# Altium schematic sheet SoM-HighSpeed.SchDoc
size A3; DocumentNumber: 3; SheetNumber: 3; SheetTotal: 9; PageSetup: Record=PageOptions|CenterHorizontal=True|CenterVertical=True|PrintScale=0.97|XCorrection=1.00|YCorrection=1.00|PrintKind=1|BorderSize=5000000|LeftOffset=0|BottomOffset=0|Orientation=2|PaperLength=2970|PaperWidth=2100|Scale=100|PaperSource=7|PrintQuality=600|MediaType=1|DitherType=10|PaperKind=A4|PrintScaleMode=1
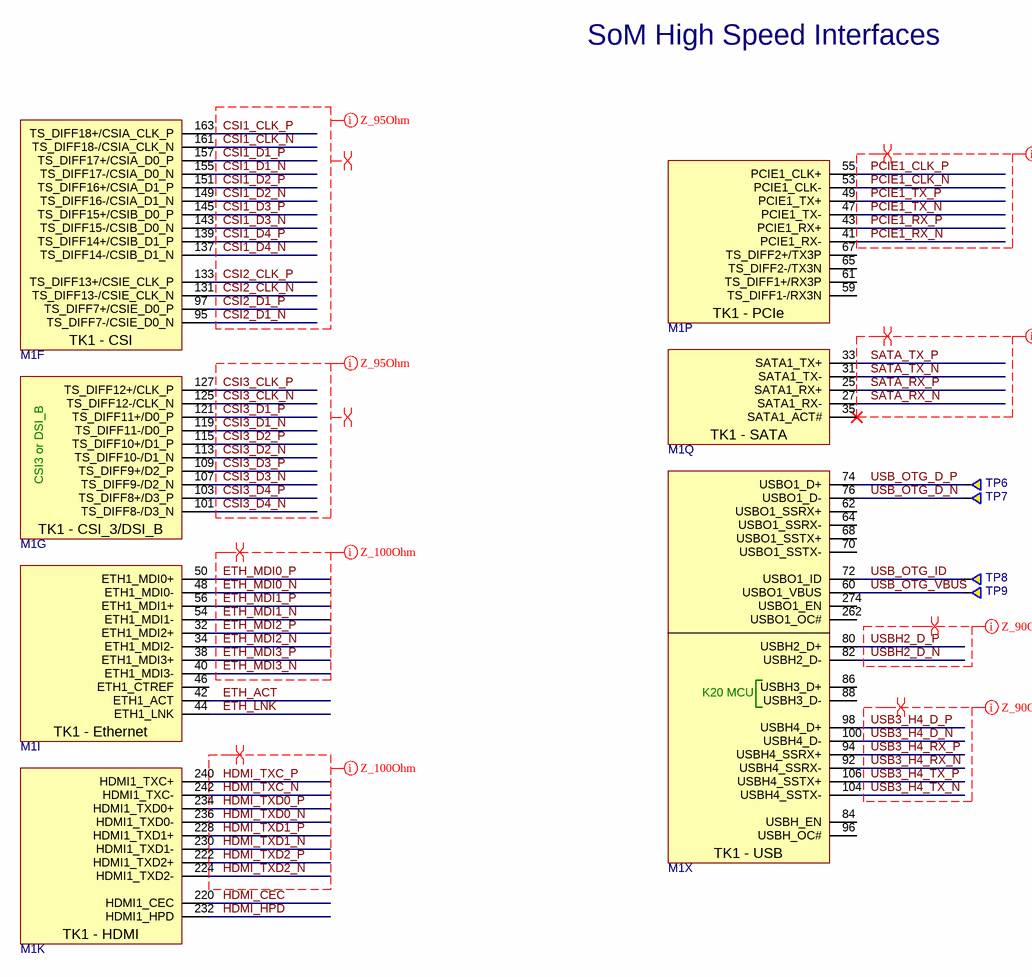
[diagram p0: SoM-HighSpeed.SchDoc]

## Parts
M1  MM70-314-310B1  [Apalis-H]  (value not drawn)  (parts F,G,I,K,P,Q,X of 25)
TP6  TP-R-1.5  [TP-R-1.5]  (value not drawn)  (no BOM)
TP7  TP-R-1.5  [TP-R-1.5]  (value not drawn)  (no BOM)
TP8  TP-R-1.5  [TP-R-1.5]  (value not drawn)  (no BOM)
TP9  TP-R-1.5  [TP-R-1.5]  (value not drawn)  (no BOM)

## Nets
CSI1_CLK_N: M1.161(TS_DIFF18-/CSIA_CLK_N)
CSI1_CLK_P: M1.163(TS_DIFF18+/CSIA_CLK_P)
CSI1_D1_N: M1.155(TS_DIFF17-/CSIA_D0_N)
CSI1_D1_P: M1.157(TS_DIFF17+/CSIA_D0_P)
CSI1_D2_N: M1.149(TS_DIFF16-/CSIA_D1_N)
CSI1_D2_P: M1.151(TS_DIFF16+/CSIA_D1_P)
CSI1_D3_N: M1.143(TS_DIFF15-/CSIB_D0_N)
CSI1_D3_P: M1.145(TS_DIFF15+/CSIB_D0_P)
CSI1_D4_N: M1.137(TS_DIFF14-/CSIB_D1_N)
CSI1_D4_P: M1.139(TS_DIFF14+/CSIB_D1_P)
CSI2_CLK_N: M1.131(TS_DIFF13-/CSIE_CLK_N)
CSI2_CLK_P: M1.133(TS_DIFF13+/CSIE_CLK_P)
CSI2_D1_N: M1.95(TS_DIFF7-/CSIE_D0_N)
CSI2_D1_P: M1.97(TS_DIFF7+/CSIE_D0_P)
CSI3_CLK_N: M1.125(TS_DIFF12-/CLK_N)
CSI3_CLK_P: M1.127(TS_DIFF12+/CLK_P)
CSI3_D1_N: M1.119(TS_DIFF11-/D0_P)
CSI3_D1_P: M1.121(TS_DIFF11+/D0_P)
CSI3_D2_N: M1.113(TS_DIFF10-/D1_N)
CSI3_D2_P: M1.115(TS_DIFF10+/D1_P)
CSI3_D3_N: M1.107(TS_DIFF9-/D2_N)
CSI3_D3_P: M1.109(TS_DIFF9+/D2_P)
CSI3_D4_N: M1.101(TS_DIFF8-/D3_N)
CSI3_D4_P: M1.103(TS_DIFF8+/D3_P)
ETH_ACT: M1.42(ETH1_ACT)
ETH_LNK: M1.44(ETH1_LNK)
ETH_MDI0_N: M1.48(ETH1_MDI0-)
ETH_MDI0_P: M1.50(ETH1_MDI0+)
ETH_MDI1_N: M1.54(ETH1_MDI1-)
ETH_MDI1_P: M1.56(ETH1_MDI1+)
ETH_MDI2_N: M1.34(ETH1_MDI2-)
ETH_MDI2_P: M1.32(ETH1_MDI2+)
ETH_MDI3_N: M1.40(ETH1_MDI3-)
ETH_MDI3_P: M1.38(ETH1_MDI3+)
HDMI_CEC: M1.220(HDMI1_CEC)
HDMI_HPD: M1.232(HDMI1_HPD)
HDMI_TXC_N: M1.242(HDMI1_TXC-)
HDMI_TXC_P: M1.240(HDMI1_TXC+)
HDMI_TXD0_N: M1.236(HDMI1_TXD0-)
HDMI_TXD0_P: M1.234(HDMI1_TXD0+)
HDMI_TXD1_N: M1.230(HDMI1_TXD1-)
HDMI_TXD1_P: M1.228(HDMI1_TXD1+)
HDMI_TXD2_N: M1.224(HDMI1_TXD2-)
HDMI_TXD2_P: M1.222(HDMI1_TXD2+)
PCIE1_CLK_N: M1.53(PCIE1_CLK-)
PCIE1_CLK_P: M1.55(PCIE1_CLK+)
PCIE1_RX_N: M1.41(PCIE1_RX-)
PCIE1_RX_P: M1.43(PCIE1_RX+)
PCIE1_TX_N: M1.47(PCIE1_TX-)
PCIE1_TX_P: M1.49(PCIE1_TX+)
SATA_RX_N: M1.27(SATA1_RX-)
SATA_RX_P: M1.25(SATA1_RX+)
SATA_TX_N: M1.31(SATA1_TX-)
SATA_TX_P: M1.33(SATA1_TX+)
USB3_H4_D_N: M1.100(USBH4_D-)
USB3_H4_D_P: M1.98(USBH4_D+)
USB3_H4_RX_N: M1.92(USBH4_SSRX-)
USB3_H4_RX_P: M1.94(USBH4_SSRX+)
USB3_H4_TX_N: M1.104(USBH4_SSTX-)
USB3_H4_TX_P: M1.106(USBH4_SSTX+)
USB_OTG_D_N: M1.76(USBO1_D-) TP7.1
USB_OTG_D_P: M1.74(USBO1_D+) TP6.1
USB_OTG_ID: M1.72(USBO1_ID) TP8.1
USB_OTG_VBUS: M1.60(USBO1_VBUS) TP9.1
USBH2_D_N: M1.82(USBH2_D-)
USBH2_D_P: M1.80(USBH2_D+)

Not connected (* = marked no-connect by the designer): M1 35(SATA1_ACT#)* 46(ETH1_CTREF) 59(TS_DIFF1-/RX3N) 61(TS_DIFF1+/RX3P) 62(USBO1_SSRX+) 64(USBO1_SSRX-) 65(TS_DIFF2-/TX3N) 67(TS_DIFF2+/TX3P) 68(USBO1_SSTX+) 70(USBO1_SSTX-) 84(USBH_EN) 86(USBH3_D+) 88(USBH3_D-) 96(USBH_OC#) 262(USBO1_OC#) 274(USBO1_EN)

## Layout directives
differential pair: CSI1_CLK_N, CSI1_CLK_P, CSI1_D1_N, CSI1_D1_P, CSI1_D2_N, CSI1_D2_P, CSI1_D3_N, CSI1_D3_P, CSI1_D4_N, CSI1_D4_P, CSI2_CLK_N, CSI2_CLK_P, CSI2_D1_N, CSI2_D1_P, CSI3_CLK_N, CSI3_CLK_P, CSI3_D1_N, CSI3_D1_P, CSI3_D2_N, CSI3_D2_P, CSI3_D3_N, CSI3_D3_P, CSI3_D4_N, CSI3_D4_P, ETH_MDI0_N, ETH_MDI0_P, ETH_MDI1_N, ETH_MDI1_P, ETH_MDI2_N, ETH_MDI2_P, ETH_MDI3_N, ETH_MDI3_P, HDMI_TXC_N, HDMI_TXC_P, HDMI_TXD0_N, HDMI_TXD0_P, HDMI_TXD1_N, HDMI_TXD1_P, HDMI_TXD2_N, HDMI_TXD2_P, PCIE1_CLK_N, PCIE1_CLK_P, PCIE1_RX_N, PCIE1_RX_P, PCIE1_TX_N, PCIE1_TX_P, SATA_RX_N, SATA_RX_P, SATA_TX_N, SATA_TX_P, USB3_H4_D_N, USB3_H4_D_P, USB3_H4_RX_N, USB3_H4_RX_P, USB3_H4_TX_N, USB3_H4_TX_P, USBH2_D_N, USBH2_D_P
net class Z_95Ohm: CSI1_CLK_N, CSI1_CLK_P, CSI1_D1_N, CSI1_D1_P, CSI1_D2_N, CSI1_D2_P, CSI1_D3_N, CSI1_D3_P, CSI1_D4_N, CSI1_D4_P, CSI2_CLK_N, CSI2_CLK_P, CSI2_D1_N, CSI2_D1_P, CSI3_CLK_N, CSI3_CLK_P, CSI3_D1_N, CSI3_D1_P, CSI3_D2_N, CSI3_D2_P, CSI3_D3_N, CSI3_D3_P, CSI3_D4_N, CSI3_D4_P, USB3_H4_D_N, USB3_H4_D_P, USB3_H4_RX_N, USB3_H4_RX_P, USB3_H4_TX_N, USB3_H4_TX_P, USBH2_D_N, USBH2_D_P
net class Z_100Ohm: ETH_MDI0_N, ETH_MDI0_P, ETH_MDI1_N, ETH_MDI1_P, ETH_MDI2_N, ETH_MDI2_P, ETH_MDI3_N, ETH_MDI3_P, HDMI_TXC_N, HDMI_TXC_P, HDMI_TXD0_N, HDMI_TXD0_P, HDMI_TXD1_N, HDMI_TXD1_P, HDMI_TXD2_N, HDMI_TXD2_P, PCIE1_CLK_N, PCIE1_CLK_P, PCIE1_RX_N, PCIE1_RX_P, PCIE1_TX_N, PCIE1_TX_P, SATA_RX_N, SATA_RX_P, SATA_TX_N, SATA_TX_P

## Notes on the sheet
- SoM High Speed Interfaces
- Title:
- Size:
- Date:
- A3
- Revision:
- Page:
- of
- Antmicro Ltd.
- File:
- www.antmicro.com
- (in symbol Apalis-TK1-H, part F) TK1 - CSI
- (in symbol Apalis-TK1-H, part G) CSI3 or DSI_B; TK1 - CSI_3/DSI_B
- (in symbol Apalis-TK1-H, part I) TK1 - Ethernet
- (in symbol Apalis-TK1-H, part K) TK1 - HDMI
- (in symbol Apalis-TK1-H, part P) TK1 - PCIe
- (in symbol Apalis-TK1-H, part Q) TK1 - SATA
- (in symbol Apalis-TK1-H, part X) K20 MCU; TK1 - USB

## Library data of the parts
M1 = Apalis-TK1-H: Toradex Apalis TK1, Horizontal; Manufacturer: JAE Electronics; Part Number: Apalis-TK1-H; Part Symbol: MM70-314-310B1; Value: MM70-314-310B1; MPN: MM70-314-310B1
TP6-TP9 = TP-R-1.5: Testpad, round, 1.5mm; Part Number: TP-R-1.5